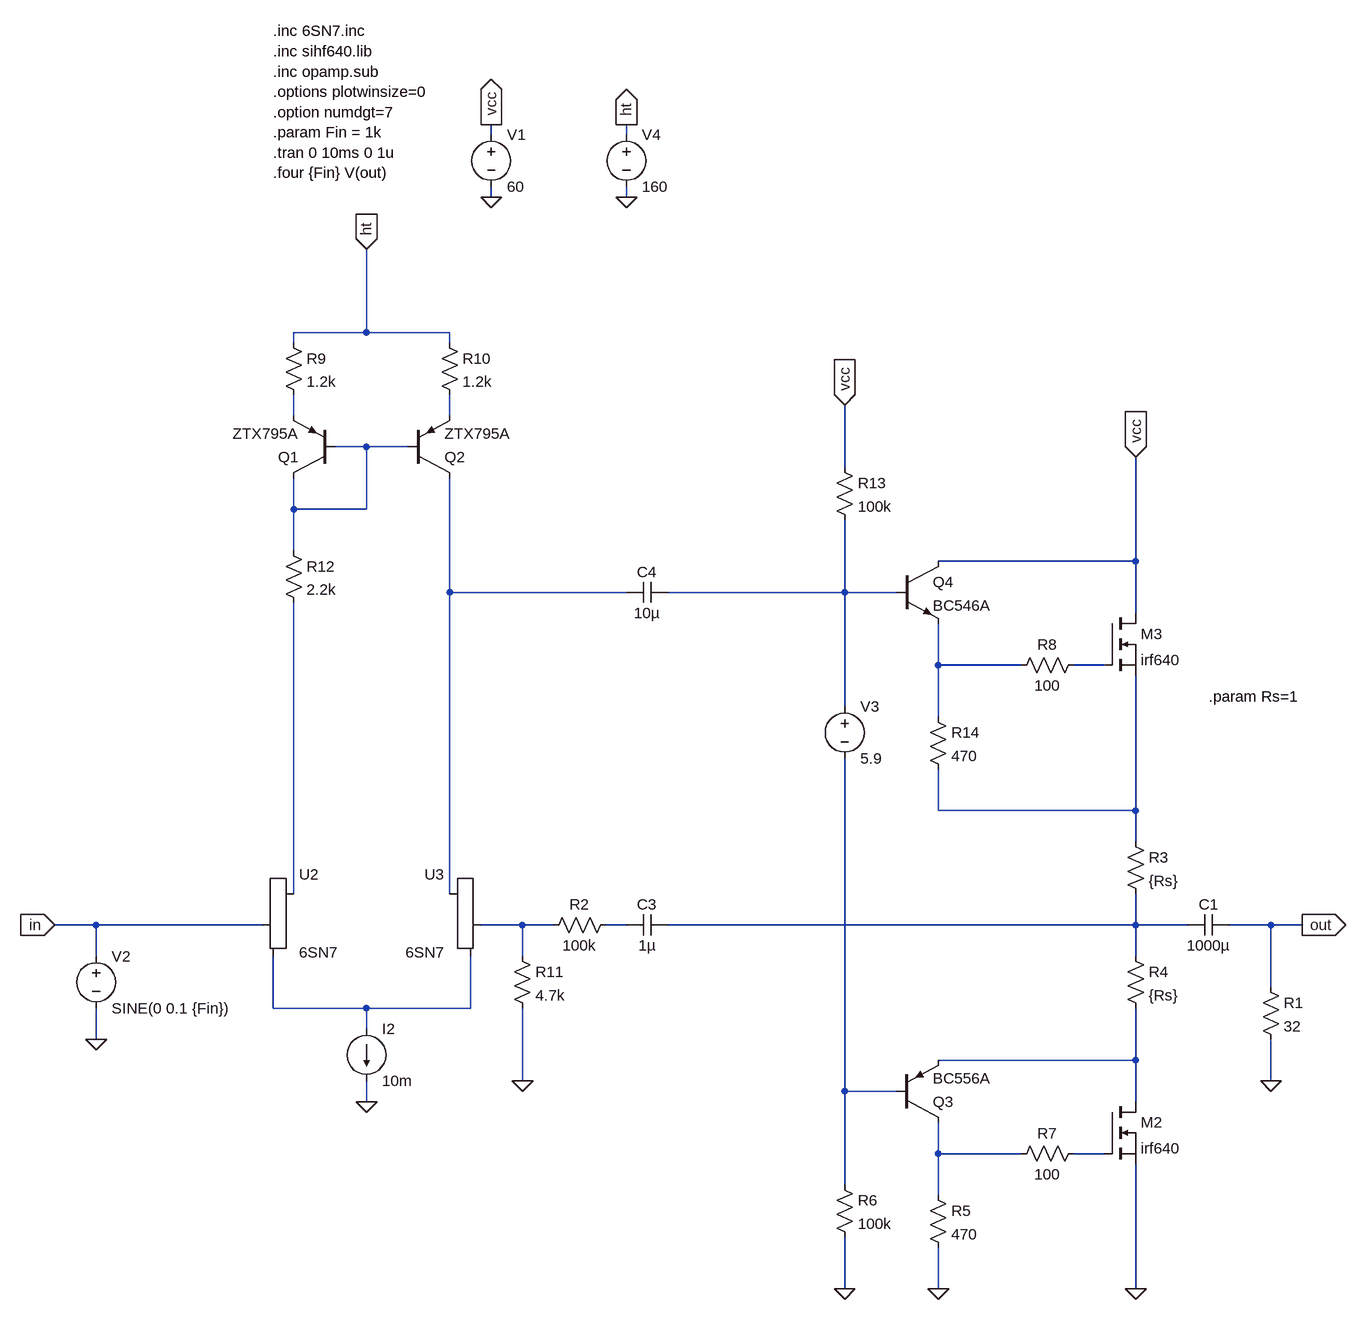
[diagram p0: schematic 6SN7 differential.asc]
6SN7 differential.asc, the LTspice schematic file:
Version 4
SHEET 1 3796 1344
WIRE 144 -448 144 -464
WIRE 352 -448 352 -464
WIRE 144 -352 144 -368
WIRE 352 -352 352 -368
WIRE -48 -144 -48 -272
WIRE -48 -144 -160 -144
WIRE 80 -144 -48 -144
WIRE -160 -128 -160 -144
WIRE 80 -128 80 -144
WIRE -160 -16 -160 -48
WIRE 80 -16 80 -48
WIRE -48 32 -96 32
WIRE 16 32 -48 32
WIRE 688 64 688 -32
WIRE -160 128 -160 80
WIRE -48 128 -48 32
WIRE -48 128 -160 128
WIRE -160 192 -160 128
WIRE 1136 208 1136 48
WIRE 1136 208 832 208
WIRE 80 256 80 80
WIRE 352 256 80 256
WIRE 688 256 688 144
WIRE 688 256 416 256
WIRE 768 256 688 256
WIRE 1136 288 1136 208
WIRE 832 368 832 304
WIRE 960 368 832 368
WIRE 1088 368 1040 368
WIRE 688 432 688 256
WIRE 832 448 832 368
WIRE 832 592 832 528
WIRE 1136 592 1136 384
WIRE 1136 592 832 592
WIRE 1136 640 1136 592
WIRE -160 720 -160 272
WIRE 80 720 80 256
WIRE -464 768 -528 768
WIRE -208 768 -464 768
WIRE 192 768 128 768
WIRE 240 768 192 768
WIRE 352 768 320 768
WIRE 1136 768 1136 720
WIRE 1136 768 416 768
WIRE 1216 768 1136 768
WIRE 1344 768 1280 768
WIRE 1392 768 1344 768
WIRE -464 816 -464 768
WIRE 192 816 192 768
WIRE 1136 816 1136 768
WIRE 1344 864 1344 768
WIRE -192 896 -192 816
WIRE -48 896 -192 896
WIRE 112 896 112 816
WIRE 112 896 -48 896
WIRE -48 928 -48 896
WIRE -464 944 -464 896
WIRE 1136 976 1136 896
WIRE 1136 976 832 976
WIRE 192 1008 192 896
WIRE 1344 1008 1344 944
WIRE 688 1024 688 512
WIRE 768 1024 688 1024
WIRE -48 1040 -48 1008
WIRE 1136 1040 1136 976
WIRE 832 1120 832 1072
WIRE 960 1120 832 1120
WIRE 1088 1120 1040 1120
WIRE 688 1168 688 1024
WIRE 832 1184 832 1120
WIRE 688 1328 688 1248
WIRE 832 1328 832 1264
WIRE 1136 1328 1136 1136
FLAG 144 -352 0
FLAG -464 944 0
FLAG 144 -464 vcc
IOPIN 144 -464 Out
FLAG -528 768 in
IOPIN -528 768 In
FLAG 1344 1008 0
FLAG 1392 768 out
IOPIN 1392 768 Out
FLAG 1136 48 vcc
IOPIN 1136 48 In
FLAG -48 -272 ht
IOPIN -48 -272 In
FLAG 192 1008 0
FLAG -48 1040 0
FLAG 1136 1328 0
FLAG 688 -32 vcc
IOPIN 688 -32 In
FLAG 352 -352 0
FLAG 352 -464 ht
IOPIN 352 -464 Out
FLAG 832 1328 0
FLAG 688 1328 0
SYMBOL voltage 144 -464 R0
SYMATTR InstName V1
SYMATTR Value 60
SYMBOL voltage -464 800 R0
SYMATTR InstName V2
SYMATTR Value SINE(0 0.1 {Fin})
SYMATTR Value2 AC 1
SYMBOL cap 1280 752 R90
WINDOW 0 0 32 VBottom 2
WINDOW 3 32 32 VTop 2
SYMATTR InstName C1
SYMATTR Value 1000µ
SYMBOL res 1328 848 R0
SYMATTR InstName R1
SYMATTR Value 32
SYMBOL nmos 1088 1040 R0
SYMATTR InstName M2
SYMATTR Value irf640
SYMATTR Prefix X
SYMBOL nmos 1088 288 R0
SYMATTR InstName M3
SYMATTR Value irf640
SYMATTR Prefix X
SYMBOL res 1120 624 R0
SYMATTR InstName R3
SYMATTR Value {Rs}
SYMBOL res 1120 800 R0
SYMATTR InstName R4
SYMATTR Value {Rs}
SYMBOL res 1056 1104 R90
WINDOW 0 0 56 VBottom 2
WINDOW 3 32 56 VTop 2
SYMATTR InstName R7
SYMATTR Value 100
SYMBOL res 1056 352 R90
WINDOW 0 0 56 VBottom 2
WINDOW 3 32 56 VTop 2
SYMATTR InstName R8
SYMATTR Value 100
SYMBOL Misc/triode -160 768 R0
SYMATTR InstName U2
SYMATTR Value 6SN7
SYMBOL Misc/triode 80 768 M0
SYMATTR InstName U3
SYMATTR Value 6SN7
SYMBOL current -48 928 R0
SYMATTR InstName I2
SYMATTR Value 10m
SYMBOL pnp 16 80 M180
SYMATTR InstName Q2
SYMATTR Value ZTX795A
SYMBOL res -176 -144 R0
SYMATTR InstName R9
SYMATTR Value 1.2k
SYMBOL res 64 -144 R0
SYMATTR InstName R10
SYMATTR Value 1.2k
SYMBOL pnp -96 80 R180
SYMATTR InstName Q1
SYMATTR Value ZTX795A
SYMBOL res 336 752 R90
WINDOW 0 0 56 VBottom 2
WINDOW 3 32 56 VTop 2
SYMATTR InstName R2
SYMATTR Value 100k
SYMBOL res 176 800 R0
SYMATTR InstName R11
SYMATTR Value 4.7k
SYMBOL res -176 176 R0
SYMATTR InstName R12
SYMATTR Value 2.2k
SYMBOL cap 416 240 R90
WINDOW 0 0 32 VBottom 2
WINDOW 3 32 32 VTop 2
SYMATTR InstName C4
SYMATTR Value 10µ
SYMBOL cap 416 752 R90
WINDOW 0 0 32 VBottom 2
WINDOW 3 32 32 VTop 2
SYMATTR InstName C3
SYMATTR Value 1µ
SYMBOL voltage 352 -464 R0
SYMATTR InstName V4
SYMATTR Value 160
SYMBOL pnp 768 1072 M180
SYMATTR InstName Q3
SYMATTR Value BC556A
SYMBOL res 816 1168 R0
SYMATTR InstName R5
SYMATTR Value 470
SYMBOL voltage 688 416 R0
SYMATTR InstName V3
SYMATTR Value 5.9
SYMBOL res 672 1152 R0
SYMATTR InstName R6
SYMATTR Value 100k
SYMBOL res 672 48 R0
SYMATTR InstName R13
SYMATTR Value 100k
SYMBOL npn 768 208 R0
SYMATTR InstName Q4
SYMATTR Value BC546A
SYMBOL res 816 432 R0
SYMATTR InstName R14
SYMATTR Value 470
TEXT -192 -608 Left 2 !.inc 6SN7.inc\n.inc sihf640.lib\n.inc opamp.sub\n.options plotwinsize=0\n.option numdgt=7\n.param Fin = 1k\n.tran 0 10ms 0 1u\n.four {Fin} V(out)
TEXT 1248 416 Left 2 !.param Rs=1

The netlist it stands for:
* 6SN7 differential.asc
V1 vcc 0 60
V2 in 0 SINE(0 0.1 {Fin}) AC 1
C1 out N012 1000µ
R1 out 0 32
XM2 N014 N017 0 irf640  ; pins D G S
XM3 vcc N007 N008 irf640  ; pins D G S
R3 N008 N012 {Rs}
R4 N012 N014 {Rs}
R7 N017 N016 100
R8 N007 N006 100
XU2 N009 in N013 6SN7
XU3 N004 N010 N013 6SN7
I2 N013 0 10m
Q2 N004 N003 N002 0 ZTX795A
R9 ht N001 1.2k
R10 ht N002 1.2k
Q1 N003 N003 N001 0 ZTX795A
R2 N011 N010 100k
R11 N010 0 4.7k
R12 N003 N009 2.2k
C4 N005 N004 10µ
C3 N012 N011 1µ
V4 ht 0 160
Q3 N016 N015 N014 0 BC556A
R5 N016 0 470
V3 N005 N015 5.9
R6 N015 0 100k
R13 vcc N005 100k
Q4 vcc N005 N006 0 BC546A
R14 N006 N008 470
.model NPN NPN
.model PNP PNP
.lib standard.bjt
.inc 6SN7.inc
.inc sihf640.lib
.inc opamp.sub
.options plotwinsize=0
.option numdgt=7
.param Fin = 1k
.tran 0 10ms 0 1u
.four {Fin} V(out)
.param Rs=1
.backanno
.end